# EAGLE board bechamel HDMI 4 board only NOT MOVING KEYS for AISLER now (EAGLE 9.6.2)
REV: C
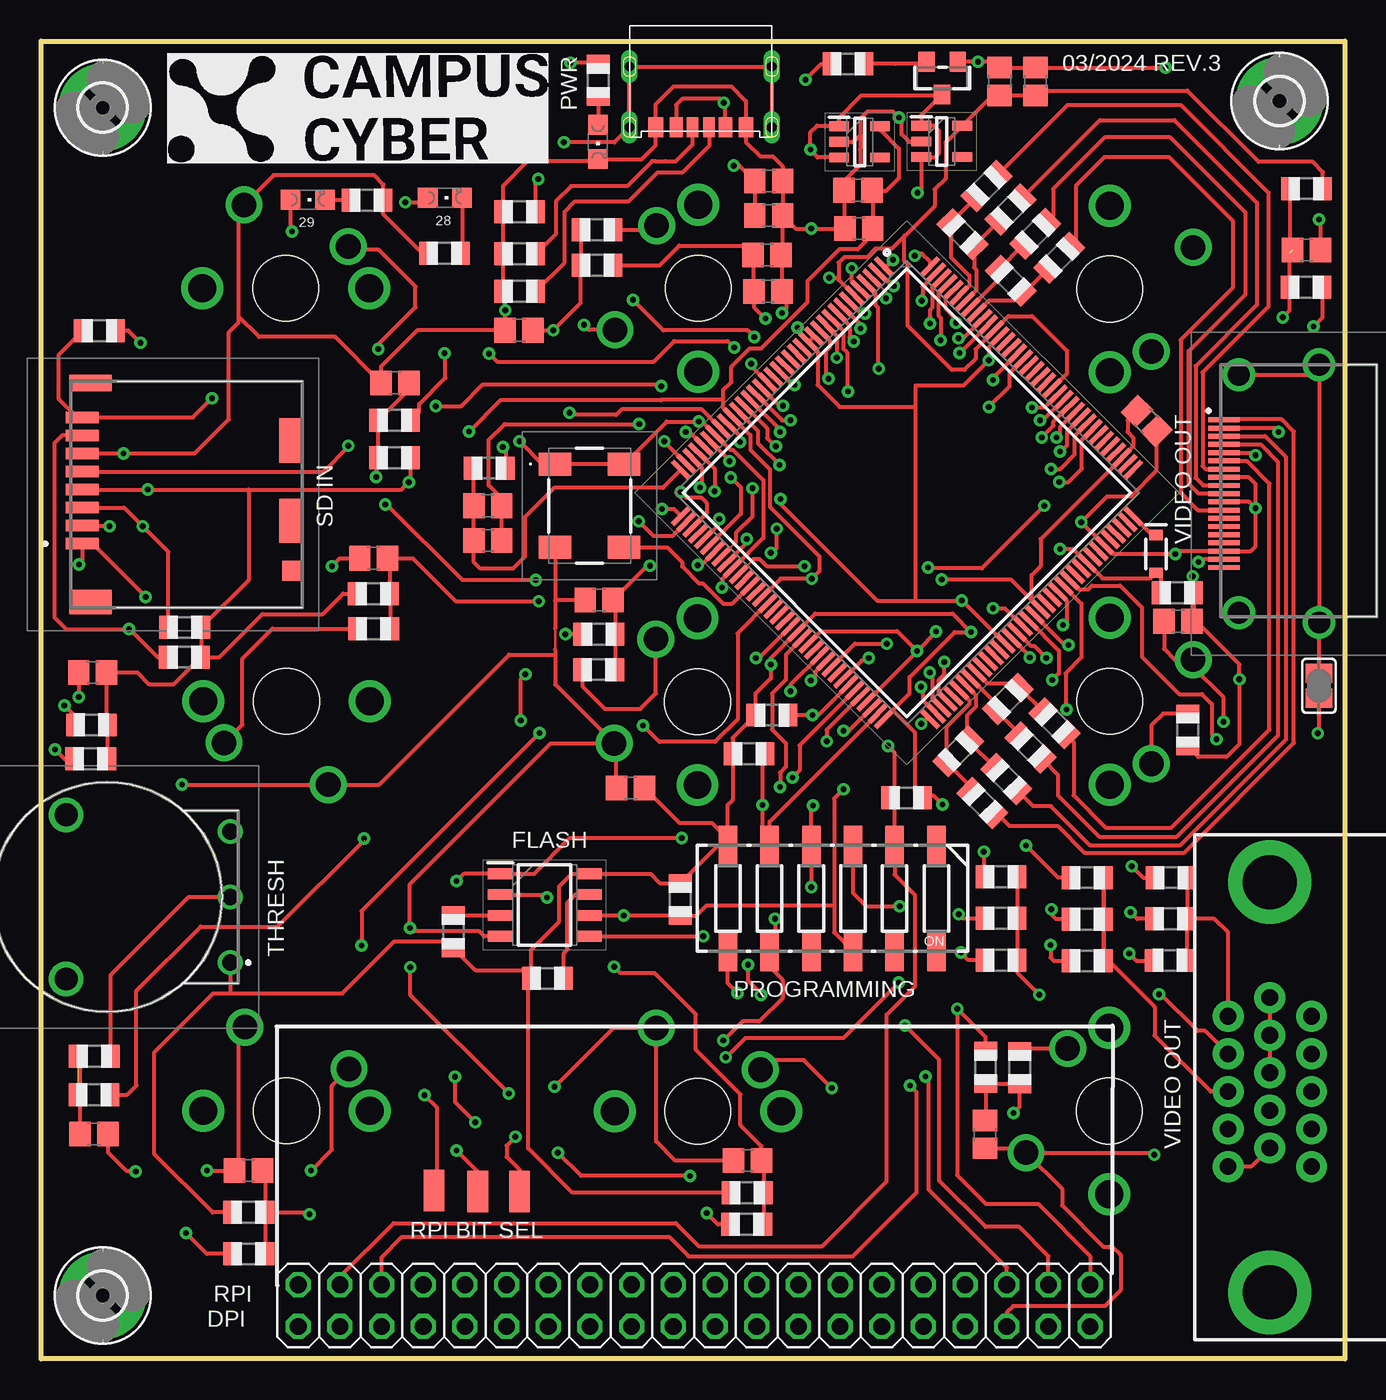
[diagram p5: board, top side]
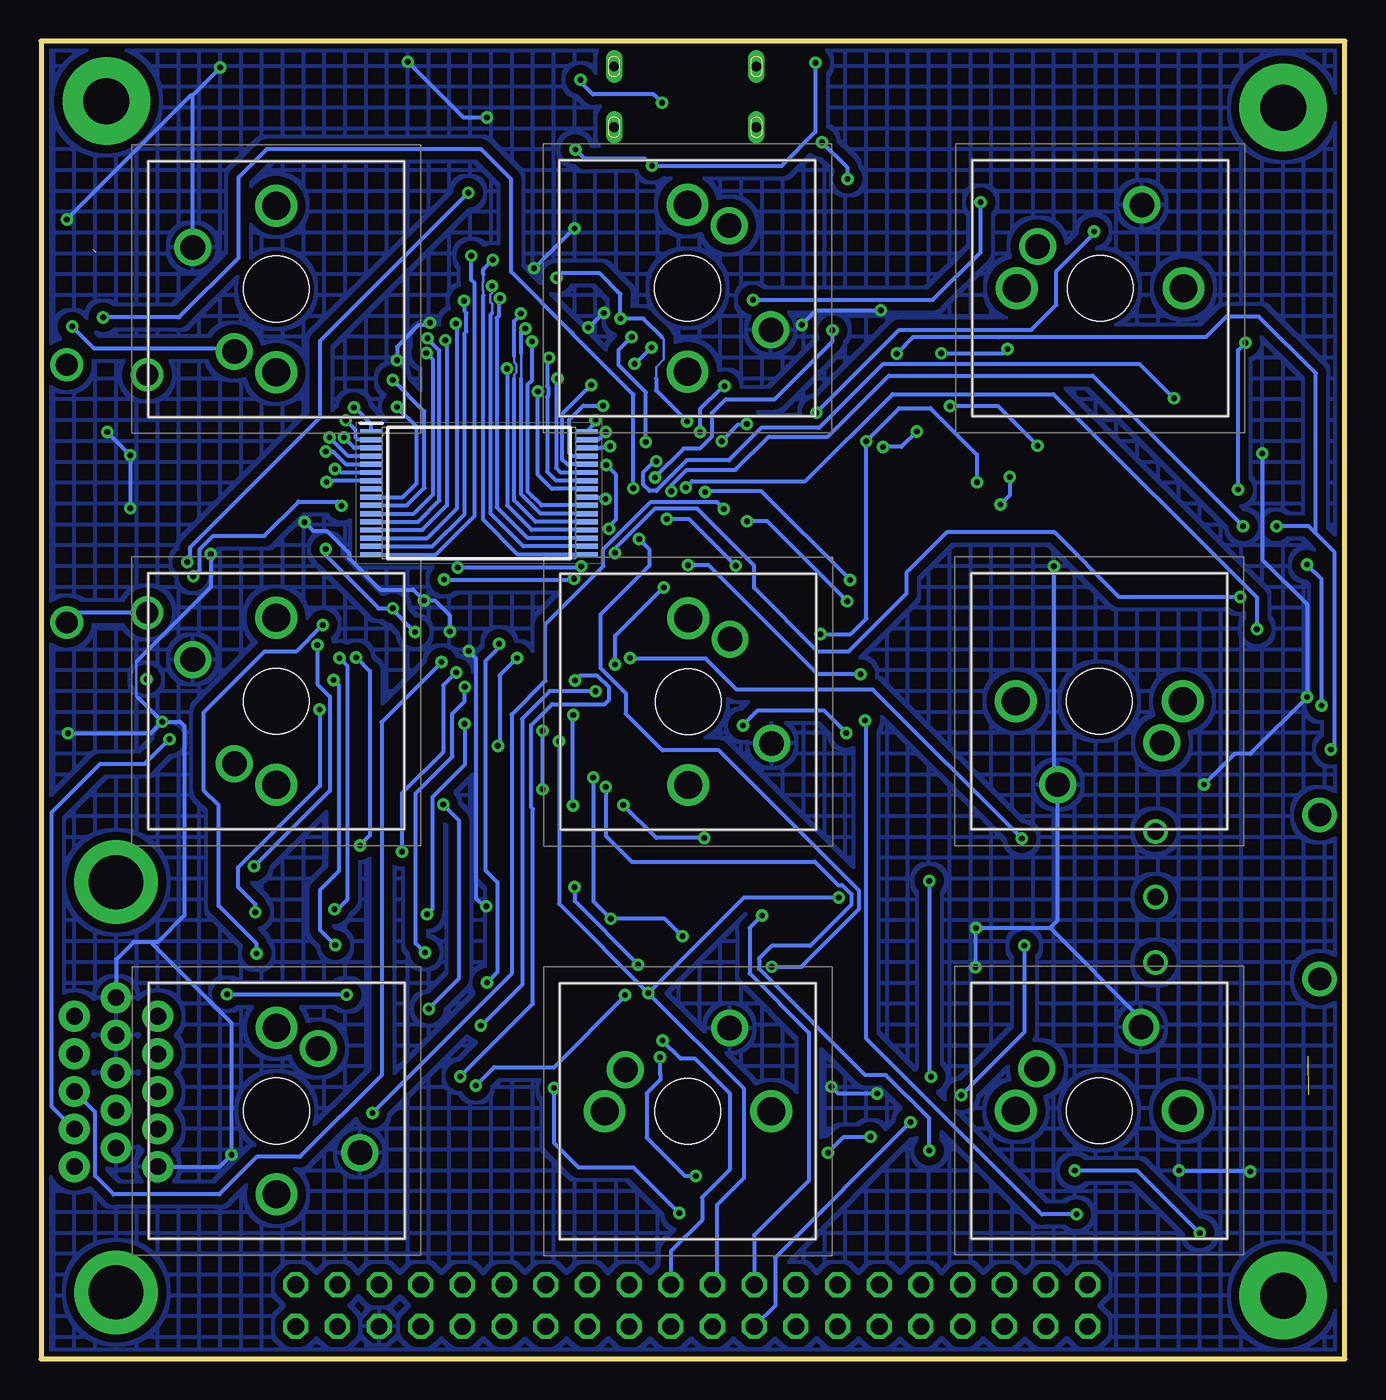
[diagram p6: board, bottom side, seen from below]

Size 79.45 x 80.31 mm. Coordinates in mm from the lower left corner, seen from the top.
Outline: 0,80.31 79.45,80.31 79.45,0 0,0 0,80.31
Copper layers (1*16): Top 0.035mm / dielectric 1.5mm / Bottom 0.035mm
Design rules "aisler_2_layer_complex *": minimum track width 0.125mm, minimum drill 0.1mm, track to track 20mil, track to pad 20mil, pad to pad 20mil, via to via 20mil, smd to smd 20mil, copper to edge 0.3mm, drill to drill 0.3mm, minimum pad ring 0.2mm, minimum via ring 0.2mm, stop-mask expansion 0mil, vias tented up to drill 0mil, thermal gap 10mil

## Footprints (pad centres in the part's own frame; a part is rotated, then mirrored left to right if it is on the bottom)
C0805 = smd 1.3 x 1.5: 1 -0.85,0; 2 0.85,0
SOD-323 = smd 0.63 x 0.83: A 1.15,0; C -1.15,0
R0805 = smd 1.1 x 1.4: 1 -1,0; 2 1,0
2,8-PAD = drill 2.8 pad 5.334: B2,8 0,0
SOT95P280X145-5N = smd 1.2 x 0.6: 1 -1.25,0.95; 2 -1.25,0; 3 -1.25,-0.95; 4 1.25,-0.95; 5 1.25,0.95
QFP50P2200X2200X160-144N = smd 1.475 x 0.3: 1 -10.738,8.75; 2 -10.738,8.25; 3 -10.738,7.75; 4 -10.738,7.25; 5 -10.738,6.75; 6 -10.738,6.25; 7 -10.738,5.75; 8 -10.738,5.25; 9 -10.738,4.75; 10 -10.738,4.25; 11 -10.738,3.75; 12 -10.738,3.25; 13 -10.738,2.75; 14 -10.738,2.25; 15 -10.738,1.75; 16 -10.738,1.25; 17 -10.738,0.75; 18 -10.738,0.25; 19 -10.738,-0.25; 20 -10.738,-0.75; 21 -10.738,-1.25; 22 -10.738,-1.75; 23 -10.738,-2.25; 24 -10.738,-2.75; 25 -10.738,-3.25; 26 -10.738,-3.75; 27 -10.738,-4.25; 28 -10.738,-4.75; 29 -10.738,-5.25; 30 -10.738,-5.75; 31 -10.738,-6.25; 32 -10.738,-6.75; 33 -10.738,-7.25; 34 -10.738,-7.75; 35 -10.738,-8.25; 36 -10.738,-8.75; 73 10.738,-8.75; 74 10.738,-8.25; 75 10.738,-7.75; 76 10.738,-7.25; 77 10.738,-6.75; 78 10.738,-6.25; 79 10.738,-5.75; 80 10.738,-5.25; 81 10.738,-4.75; 82 10.738,-4.25; 83 10.738,-3.75; 84 10.738,-3.25; 85 10.738,-2.75; 86 10.738,-2.25; 87 10.738,-1.75; 88 10.738,-1.25; 89 10.738,-0.75; 90 10.738,-0.25; 91 10.738,0.25; 92 10.738,0.75; 93 10.738,1.25; 94 10.738,1.75; 95 10.738,2.25; 96 10.738,2.75; 97 10.738,3.25; 98 10.738,3.75; 99 10.738,4.25; 100 10.738,4.75; 101 10.738,5.25; 102 10.738,5.75; 103 10.738,6.25; 104 10.738,6.75; 105 10.738,7.25; 106 10.738,7.75; 107 10.738,8.25; 108 10.738,8.75 | smd 0.3 x 1.475: 37 -8.75,-10.738; 38 -8.25,-10.738; 39 -7.75,-10.738; 40 -7.25,-10.738; 41 -6.75,-10.738; 42 -6.25,-10.738; 43 -5.75,-10.738; 44 -5.25,-10.738; 45 -4.75,-10.738; 46 -4.25,-10.738; 47 -3.75,-10.738; 48 -3.25,-10.738; 49 -2.75,-10.738; 50 -2.25,-10.738; 51 -1.75,-10.738; 52 -1.25,-10.738; 53 -0.75,-10.738; 54 -0.25,-10.738; 55 0.25,-10.738; 56 0.75,-10.738; 57 1.25,-10.738; 58 1.75,-10.738; 59 2.25,-10.738; 60 2.75,-10.738; 61 3.25,-10.738; 62 3.75,-10.738; 63 4.25,-10.738; 64 4.75,-10.738; 65 5.25,-10.738; 66 5.75,-10.738; 67 6.25,-10.738; 68 6.75,-10.738; 69 7.25,-10.738; 70 7.75,-10.738; 71 8.25,-10.738; 72 8.75,-10.738; 109 8.75,10.738; 110 8.25,10.738; 111 7.75,10.738; 112 7.25,10.738; 113 6.75,10.738; 114 6.25,10.738; 115 5.75,10.738; 116 5.25,10.738; 117 4.75,10.738; 118 4.25,10.738; 119 3.75,10.738; 120 3.25,10.738; 121 2.75,10.738; 122 2.25,10.738; 123 1.75,10.738; 124 1.25,10.738; 125 0.75,10.738; 126 0.25,10.738; 127 -0.25,10.738; 128 -0.75,10.738; 129 -1.25,10.738; 130 -1.75,10.738; 131 -2.25,10.738; 132 -2.75,10.738; 133 -3.25,10.738; 134 -3.75,10.738; 135 -4.25,10.738; 136 -4.75,10.738; 137 -5.25,10.738; 138 -5.75,10.738; 139 -6.25,10.738; 140 -6.75,10.738; 141 -7.25,10.738; 142 -7.75,10.738; 143 -8.25,10.738; 144 -8.75,10.738
SOIC127P600X175-8N = smd 1.525 x 0.65: 1 -2.712,1.905; 2 -2.712,0.635; 3 -2.712,-0.635; 4 -2.712,-1.905; 5 2.712,-1.905; 6 2.712,-0.635; 7 2.712,0.635; 8 2.712,1.905
SOP50P1340X125-32N = smd 1.325 x 0.3: 1 -6.562,3.75; 2 -6.562,3.25; 3 -6.562,2.75; 4 -6.562,2.25; 5 -6.562,1.75; 6 -6.562,1.25; 7 -6.562,0.75; 8 -6.562,0.25; 9 -6.562,-0.25; 10 -6.562,-0.75; 11 -6.562,-1.25; 12 -6.562,-1.75; 13 -6.562,-2.25; 14 -6.562,-2.75; 15 -6.562,-3.25; 16 -6.562,-3.75; 17 6.562,-3.75; 18 6.562,-3.25; 19 6.562,-2.75; 20 6.562,-2.25; 21 6.562,-1.75; 22 6.562,-1.25; 23 6.562,-0.75; 24 6.562,-0.25; 25 6.562,0.25; 26 6.562,0.75; 27 6.562,1.25; 28 6.562,1.75; 29 6.562,2.25; 30 6.562,2.75; 31 6.562,3.25; 32 6.562,3.75
SS53000001 = smd 0.3 x 1.9: 1 4.5,4.165; 2 4,4.165; 3 3.5,4.165; 4 3,4.165; 5 2.5,4.165; 6 2,4.165; 7 1.5,4.165; 8 1,4.165; 9 0.5,4.165; 10 0,4.165; 11 -0.5,4.165; 12 -1,4.165; 13 -1.5,4.165; 14 -2,4.165; 15 -2.5,4.165; 16 -3,4.165; 17 -3.5,4.165; 18 -4,4.165; 19 -4.5,4.165 | drill 1.33 pad 1.995: MH1 -7.25,3.265; MH2 7.25,3.265; MH3 7.85,-1.635; MH4 -7.85,-1.635
DM3CSSF = smd 0.7 x 2: 1 3,-6.35; 2 1.9,-6.35; 3 0.8,-6.35; 4 -0.3,-6.35; 5 -1.4,-6.35; 6 -2.5,-6.35; 7 -3.6,-6.35; 8 -4.7,-6.35 | smd 1 x 2.6: MP1 -6.8,-5.85 | smd 1.5 x 2.6: MP2 6.55,-5.85 | smd 2.7 x 1.4: MP3 -3.3,6.35; MP4 1.6,6.35 | smd 1.2 x 1.2: MP5 4.65,6.45
2X20 = drill 1.016 octagon: 1 -24.13,-1.27; 2 -24.13,1.27; 3 -21.59,-1.27; 4 -21.59,1.27; 5 -19.05,-1.27; 6 -19.05,1.27; 7 -16.51,-1.27; 8 -16.51,1.27; 9 -13.97,-1.27; 10 -13.97,1.27; 11 -11.43,-1.27; 12 -11.43,1.27; 13 -8.89,-1.27; 14 -8.89,1.27; 15 -6.35,-1.27; 16 -6.35,1.27; 17 -3.81,-1.27; 18 -3.81,1.27; 19 -1.27,-1.27; 20 -1.27,1.27; 21 1.27,-1.27; 22 1.27,1.27; 23 3.81,-1.27; 24 3.81,1.27; 25 6.35,-1.27; 26 6.35,1.27; 27 8.89,-1.27; 28 8.89,1.27; 29 11.43,-1.27; 30 11.43,1.27; 31 13.97,-1.27; 32 13.97,1.27; 33 16.51,-1.27; 34 16.51,1.27; 35 19.05,-1.27; 36 19.05,1.27; 37 21.59,-1.27; 38 21.59,1.27; 39 24.13,-1.27; 40 24.13,1.27
CHIPLED_0805 = smd 1.2 x 1.2: A 0,-1.05; C 0,1.05
SOT23-WIDE = smd 1 x 1.2: 1 -0.95,-1; 2 0.95,-1; 3 0,1
SMD1,27-2,54 = smd 1.27 x 2.54: 1 0,0
MX1A11NW = drill 1.499 pad 2.248: 1 0,0; 2 6.35,2.54 | drill 1.702 pad 2.553: MH1 -1.27,-2.54; MH2 8.89,-2.54 | hole 3.988: 3.81,-2.54
CTS-219-06J = smd 1.13 x 2.44: 1 -6.35,-3.215; 2 -3.81,-3.215; 3 -1.27,-3.215; 4 1.27,-3.215; 5 3.81,-3.215; 6 6.35,-3.215; 7 6.35,3.215; 8 3.81,3.215; 9 1.27,3.215; 10 -1.27,3.215; 11 -3.81,3.215; 12 -6.35,3.215
SJ = smd 1.168 x 1.6: 1 -0.762,0; 2 0.762,0
DB15 = drill 1.016 pad 1.88: 1 -4.32,-7.62; 2 -2.03,-7.62; 3 0.26,-7.62; 4 2.55,-7.62; 5 4.84,-7.62; 6 -5.46,-5.08; 7 -3.17,-5.08; 8 -0.88,-5.08; 9 1.41,-5.08; 10 3.7,-5.08; 11 -4.32,-2.54; 12 -2.03,-2.54; 13 0.26,-2.54; 14 2.55,-2.54; 15 4.84,-2.54 | drill 3.302 pad 5.08: G1 -12.5,-5.08; G2 12.5,-5.08
USCX-06FX-XXMX-01 = smd 0.7 x 1.2: CC1 0.5,-1.75; CC2 -0.5,-1.75 | smd 0.9 x 1.2: GND1 2.75,-1.75; GND2 -2.75,-1.75 | drill 0.6 long: SHIELD1 4.325,1.95; SHIELD2 4.325,-1.75; SHIELD3 -4.35,-1.75; SHIELD4 -4.35,1.95 | smd 0.8 x 1.2: VBUS1 1.5,-1.75; VBUS2 -1.5,-1.75
RV100F304K1BB10KB301 = drill 1 pad 1.5: 1 0,0; 2 4,0; 3 8,0 | drill 1.4 pad 2.1: 4 -1,10; 5 9,10
ECS3953M080BNTTR = smd 1.4 x 2: 1 -2.54,-2.1; 2 2.54,-2.1; 3 2.54,2.1; 4 -2.54,2.1

## Placement (x,y rotation side)
C1  0.1uF  [C0805]  34.01,46.25 0 top
C3  10uF  [C0805]  44.35,71.78 0 top
C4  10uF  [C0805]  49.83,68.88 180 top
C5  10uF  [C0805]  44.35,69.67 0 top
C6  0.1uF  [C0805]  20.27,48.79 0 top
C7  0.1uF  [C0805]  12.65,11.48 0 top
C8  0.1uF  [C0805]  43.05,12.09 0 top
C9  0.1uF  [C0805]  77.11,67.59 180 top
C10  0.1uF  [C0805]  29.13,62.69 0 top
C11  0.1uF  [C0805]  21.56,59.49 0 top
C12  0.1uF  [C0805]  58.42,77.85 90 top
C13  0.1uF  [C0805]  57.53,13.69 90 top
C14  0.1uF  [C0805]  69.29,44.96 0 top
C15  0.1uF  [C0805]  44.25,67.28 0 top
C16  10uF  [C0805]  3.15,41.83 0 top
C17  5.6nF  [C0805]  3.23,13.72 180 top
C18  0.1uF  [C0805]  44.3,65.06 0 top
C21  0.1uF  [C0805]  60.6,77.85 90 top
C22  0.1uF  [C0805]  27.23,49.89 0 top
C23  10uF  [C0805]  27.23,51.99 0 top
C25  0.1uF  [C0805]  35.92,34.8 180 top
C26  0.1uF  [C0805]  49.78,71.22 180 top
C27  0.1uF  [C0805]  67.37,57.16 315 top
D1  250mA/100V  [SOD-323]  67.95,49.06 270 top
FUSE  FUSE  [R0805]  49.17,78.92 180 top
H1  MOUNT-PAD-ROUND2.8  [2,8-PAD]  3.76,3.86 0 top
H5  MOUNT-PAD-ROUND2.8  [2,8-PAD]  3.76,76.25 0 top
H6  MOUNT-PAD-ROUND2.8  [2,8-PAD]  75.46,76.66 0 top
IC1  TLV73333PDBVT  [SOT95P280X145-5N]  54.89,74.19 0 top
IC2  ICE40HX1K-TQ144  [QFP50P2200X2200X160-144N]  52.77,52.78 315 top
IC3  TLV73312PDBVT  [SOT95P280X145-5N]  49.89,74.17 0 top
IC4  N25Q032A13ESC40F  [SOIC127P600X175-8N]  30.68,27.66 0 top
IC6  IS62WV2568BLL-55HLI  [SOP50P1340X125-32N]  52.76,52.77 0 bottom
J2  SS-53000-001  [SS53000001]  76.25,52.73 90 top
J3  DM3CS-SF  [DM3CSSF]  8.86,52.68 270 top
JP1  [2X20]  39.8,3.25 180 top
LED6  [CHIPLED_0805]  33.93,74.17 180 top
LED12  [CHIPLED_0805]  24.61,70.76 270 top
LED13  [CHIPLED_0805]  16.25,70.64 270 top
P-FET2  [SOT23-WIDE]  54.91,78.05 180 top
PAD1  [SMD1,27-2,54]  23.95,10.26 0 top
PAD2  [SMD1,27-2,54]  26.62,10.21 0 top
PAD3  [SMD1,27-2,54]  29.16,10.21 0 top
R1  470R  [R0805]  63.75,29.34 0 top
R2  1K  [R0805]  33.99,42.01 0 top
R3  10K  [R0805]  20.24,46.63 180 top
R4  10K  [R0805]  33.99,44.17 180 top
R5  1K  [R0805]  20.27,44.5 0 top
R6  10K  [R0805]  12.65,8.94 180 top
R7  1K  [R0805]  12.65,6.4 0 top
R8  10K  [R0805]  52.74,34.19 0 top
R9  10K  [R0805]  44.54,39.24 180 top
R10  10K  [R0805]  30.86,23.19 180 top
R11  10K  [R0805]  25.13,26.04 270 top
R12  10K  [R0805]  43.14,36.88 180 top
R13  10K  [R0805]  38.96,28 90 top
R14  100 ohm  [R0805]  27.3,54.29 0 top
R15  1K  [R0805]  63.75,26.8 0 top
R16  1.8K  [R0805]  63.75,24.26 0 top
R17  470R  [R0805]  58.5,29.39 0 top
R18  1K  [R0805]  58.5,24.31 0 top
R19  300 ohm  [R0805]  33.96,77.92 90 top
R20  1.8K  [R0805]  58.5,26.85 0 top
R21  10K  [R0805]  43.03,10.13 180 top
R22  1K  [R0805]  43,8.2 0 top
R23  10K  [R0805]  77.11,71.32 0 top
R24  1K  [R0805]  77.09,65.3 180 top
R25  470R  [R0805]  68.86,29.34 0 top
R26  1K  [R0805]  68.81,24.28 0 top
R27  1.8K  [R0805]  68.83,26.82 0 top
R28  270R  [R0805]  57.36,33.88 135 top
R29  270R  [R0805]  58.82,35.34 135 top
R30  120R  [R0805]  55.89,37.04 45 top
R31  270R  [R0805]  60.29,37.27 135 top
R32  270R  [R0805]  61.76,38.74 135 top
R33  120R  [R0805]  58.91,40.21 45 top
R34  270R  [R0805]  57.61,71.49 225 top
R35  270R  [R0805]  59.08,70.04 225 top
R36  100 ohm  [R0805]  24.59,67.39 0 top
R37  100 ohm  [R0805]  19.86,70.61 180 top
R38  120R  [R0805]  56.15,68.54 315 top
R39  270R  [R0805]  60.59,68.57 225 top
R40  270R  [R0805]  62.05,67.11 225 top
R41  120R  [R0805]  59.09,65.71 315 top
R42  1M  [R0805]  29.16,69.9 180 top
R43  5k1  [R0805]  29.16,67.36 180 top
R44  5k1  [R0805]  29.16,65.07 180 top
R45  10K  [R0805]  3.07,38.63 0 top
R46  10K  [R0805]  33.88,66.65 0 top
R47  1K  [R0805]  33.88,68.81 180 top
R48  10K  [R0805]  21.54,54.91 0 top
R49  1K  [R0805]  21.54,57.2 180 top
R50  10K  [R0805]  57.56,17.78 90 top
R51  1K  [R0805]  59.64,17.75 270 top
R52  10K  [R0805]  69.24,46.69 180 top
R53  1K  [R0805]  69.88,38.33 270 top
R54  10K  [R0805]  8.76,44.58 0 top
R55  10K  [R0805]  8.74,42.77 180 top
R56  1K8 ohm  [R0805]  3.25,18.44 0 top
R57  180 ohm  [R0805]  3.23,16.1 0 top
R58  10K  [R0805]  3.02,36.58 0 top
R59  10K  [R0805]  3.56,62.66 0 top
S1  MX1A-11NW  [MX1A11NW]  18.72,67.79 0 bottom
S2  MX1A-11NW  [MX1A11NW]  37.52,69.06 270 bottom
S3  MX1A-11NW  [MX1A11NW]  67.67,61.39 90 bottom
S4  MX1A-11NW  [MX1A11NW]  67.67,36.27 90 bottom
S5  MX1A-11NW  [MX1A11NW]  11.15,37.54 180 bottom
S6  MX1A-11NW  [MX1A11NW]  37.46,43.87 270 bottom
S7  MX1A-11NW  [MX1A11NW]  18.77,17.68 0 bottom
S8  MX1A-11NW  [MX1A11NW]  43.84,17.63 0 bottom
S9  219-06J  [CTS-219-06J]  48.21,28.07 180 top
S13  MX1A-11NW  [MX1A11NW]  62.56,18.92 270 bottom
SJ2  [SJ]  77.88,41.02 270 top
U$1  DB15  [DB15]  79.96,16.56 270 top
U$2  USBC-6P  [USCX-06FX-XXMX-01]  40.21,76.81 0 top
VR1  RV100F-30-4K1B-B10K-B301  [RV100F304K1BB10KB301]  11.53,24.16 90 top
Y2  ECS-3953M-080-BN-T-TR  [ECS3953M080BNTTR]  33.43,51.99 270 top

## Tracks (layer width: path | path; a pad name or v marks a point on that pad's centre or on a via)
1.2V  (via drill 0.35)
  Top 0.254: 50.79,75.12 IC3.5 51.14,74.9 52.27,73.76 52.27,71.96 51.49,71.17 50.69,71.17 | C26.1 50.69,71.17 | 50.69,71.17 C4.1 50.69,68.53 49.77,67.61 48.64,67.61 46.7,65.68 46.7,64.4 43.9,61.59 43.2,61.59 42.07,60.46 42.07,59.53 41.55,59.02 41.55,58.47 | 41.55,58.47 41.55,57.98 IC2.27 43.23,56.3 43.23,55.39 44.42,54.2 44.42,51.92 47.45,48.89 47.45,48.03 v46.96,47.55 45.07,47.55 IC2.51 | C27.1 66.22,57.21 66.22,56.49 66.57,56.13 66.57,55.62 IC2.111 60.91,49.96 60.91,48.31 60.37,47.77 60.37,46.23 60.88,45.72 IC2.92 59.11,47.5 v54.89,47.5 | v26.09,56.51 27.99,58.42 37.77,58.42 37.82,58.47 41.55,58.47 | v28.14,55.57 28.31,55.41 R14.2
  Bottom 0.254: v26.09,56.51 27.03,55.57 v28.14,55.57 | v54.89,47.5 47.02,47.5 v46.96,47.55
3.3V  (via drill 0.35)
  Top 0.254: 48.61,65.89 48.61,66.81 48.95,67.15 50.34,67.15 50.85,67.67 51.84,67.67 52.63,68.45 52.63,68.43 | 48.61,65.89 48.61,65.76 49.58,64.79 IC2.6 | 52.63,68.43 54.46,70.26 54.46,71.27 55.12,71.93 55.12,74.12 IC1.5 58,77 C12.1 C21.1 60.9,77.29 69.85,77.29 74.19,72.95 77.5,72.95 78.11,72.33 R23.2 77.88,71.56 | 52.63,68.43 52.58,68.38 52.58,66.93 52.81,66.7 52.81,62.97 55.5,60.27 56.26,60.27 56.95,60.96 56.95,61.54 IC2.133 58.95,63.55 60.4,63.55 62.51,61.44 62.51,60.04 IC2.123 | v62.1,49.35 v62.11,49.36 62.91,49.36 IC2.100 64.69,47.57 67.61,47.57 D1.A 68.24,47.61 R52.2 | IC2.72 51.9,39.54 | S9.6 42.06,31.48 40.87,32.66 38.9,32.66 C25.1 | S9.6 41.24,31.28 R13.2 37.72,29 37.16,29.57 IC4.8 32.33,29.57 31.57,28.8 31.57,26.64 29.86,24.93 R10.2 29.69,23.36 | 51.9,39.54 53.24,38.2 53.24,34.69 53.62,34.31 | 53.62,34.31 R8.2 | 29.69,23.36 29.35,23.7 26.47,23.7 R11.2 24.72,25.45 21.54,25.45 18.36,22.28 11.53,22.28 | R50.2 57.56,19.61 v55.83,21.34 55.83,11.2 57.58,9.45 60.76,9.45 63.93,6.27 JP1.1 | v54.94,33.78 54.41,34.31 53.62,34.31 | R21.2 32.39,10.13 29.69,12.83 29.69,23.36 | R6.2 10.46,8.94 6.91,12.49 6.91,18.69 10.49,22.28 11.53,22.28 | R3.2 18.41,46.63 17.16,45.39 13.49,45.39 10.87,42.77 R55.1 | R4.2 v31.95,44.17 | C15.1 43.4,67.23 | 43.4,67.23 43.4,65.11 C18.1 43.45,64.1 v44.15,63.4 | R46.2 37.69,66.65 38.89,67.84 42.79,67.84 43.4,67.23 | 51.9,39.54 52.93,40.57 52.93,41.55 55.68,44.3 v56.67,44.3 55.55,45.41 47.18,45.41 IC2.57 44.48,42.72 v44.48,42.32 44.48,41.48 43.54,40.54 R9.2 42.14,37.85 R12.2 42.14,34.06 41.86,33.78 S9.6 | v29.16,55.93 30.56,54.53 Y2.1 Y2.4 38.12,57.12 v40.08,57.12 40.29,57.12 IC2.30 42.03,55.39 42.18,55.39 44.02,53.55 44.02,50.04 IC2.46 41.5,47.52 v41.5,47.02
  Top 0.254: v58.01,45.75 58.74,45.75 IC2.89 | v48.03,65.89 48.61,65.89 | VR1.1 11.53,22.28 | R48.2 22.54,53.55 v22.42,53.43 21.97,52.98 12.65,52.98 | 12.65,52.98 v6.5,52.98 J3.4 | R55.1 8.08,41.12 6.58,41.12 5.87,41.83 C16.2 4,38.71 R45.2 4.02,38.58 R58.2 | 12.65,52.98 12.65,47.46 R54.2 9.76,42.81 R55.1 | v6.05,61.92 5.32,62.66 R59.2
  Bottom 0.152: 41.97,59.74 41.97,60.45 41.49,60.92 41.49,62.14 41.63,62.28
  Bottom 0.254: v56.67,44.3 58.01,45.64 v58.01,45.75 58.88,45.75 62.1,48.97 v62.1,49.35 | v54.94,33.78 54,32.84 54,23.16 v55.83,21.34 | v31.95,44.17 30.1,44.17 29.16,45.11 v29.16,55.93 27.15,57.94 25.25,57.94 22.42,55.1 v22.42,53.43 | v40.08,57.12 40.08,57.13 41.97,59.02 41.97,59.74 | 41.63,62.28 42.75,63.4 v44.15,63.4 44.15,64.9 45.44,66.19 47.73,66.19 v48.03,65.89 | v41.5,47.02 44.48,44.04 v44.48,42.32 | v6.05,61.92 6.5,61.48 v6.5,52.98
5V  (via drill 0.35)
  Top 0.254: P-FET2.3 54.86,77 | 54.86,77 53.64,75.78 IC1.1 54.42,75.14 54.74,74.83 54.74,73.48 54.5,73.24 IC1.3 53.64,71.29 v53.42,71.07 | IC3.1 48.64,75.16 | 48.64,75.16 48.64,75.64 50,77 54.86,77 | IC3.3 47.33,73.22 46.89,73.66 v46.89,73.71 46.89,74.75 47.3,75.16 48.64,75.16 | C5.1 C3.1 42.56,72.72 v42.22,72.72 | J2.18 70.88,48.73 70.71,48.56 v70.54,48.56 | R19.2 33.88,78.99 v32.26,78.99
  Bottom 0.254: v53.42,71.07 62.46,62.03 62.46,57.35 70.38,49.43 70.38,48.72 v70.54,48.56 | v46.89,73.71 46.3,73.13 42.62,73.13 v42.22,72.72 42.19,72.69 34.34,72.69 32.26,74.78 v32.26,78.99
5V?
  Top 0.254: P-FET2.2 53.84,78.93 52.07,78.93 52.06,78.92 FUSE.1
!CS1  (via drill 0.35)
  Top 0.254: IC2.25 44.25,56.71 44.25,56.11 44.73,55.63 v44.78,55.63
  Bottom 0.254: IC6.30 45.92,55.52 45.34,55.52 44.89,55.52 v44.78,55.63
!OE  (via drill 0.35)
  Top 0.254: IC2.23 45.17,57.2 v45.67,57.2
  Bottom 0.254: IC6.32 45.67,57.05 v45.67,57.2
!WE  (via drill 0.35)
  Top 0.254: IC2.118 62.51,56.51 62.51,55.65 62.13,55.27 v62.1,55.3
  Bottom 0.254: v62.1,55.3 61.65,55.3 60.88,54.53 59.34,54.53 IC6.5
A0  (via drill 0.35)
  Top 0.254: IC2.4 50.84,64.96 50.84,64.25 51,64.09 51,60.4 v51.05,60.35
  Bottom 0.254: IC6.20 49.55,50.52 51.05,52.02 v51.05,60.35
A1  (via drill 0.35)
  Top 0.152: v51.49,64.64 51.49,64.82 51.49,65.02 IC2.3
  Bottom 0.254: IC6.19 49.79,50.02 51.69,51.92 51.69,63.42 51.56,63.55 51.56,64.57 v51.49,64.64
A2  (via drill 0.35)
  Top 0.254: IC2.2 51.56,65.66 51.69,65.66 v51.97,65.38
  Bottom 0.152: 51.97,63.73 51.97,64.31 52.06,64.4 52.06,64.88 51.97,64.97 v51.97,65.38
  Bottom 0.254: IC6.18 50.05,49.52 52.07,51.54 52.07,63.63 51.97,63.73
A3  (via drill 0.35)
  Top 0.254: IC2.1 51.5,66.56 v51.92,66.98
  Bottom 0.152: 52.5,64.82 52.5,65.1 52.54,65.14 52.54,65.62 52.5,65.66 52.5,66.09
  Bottom 0.254: IC6.17 50.39,49.02 52.5,51.13 52.5,64.82 | v51.92,66.98 52.5,66.4 52.5,66.09
A4  (via drill 0.35)
  Top 0.254: IC2.144 54.18,66.86 53.68,67.36 53.37,67.36 v53.24,67.23
  Bottom 0.254: IC6.16 55.4,49.02 53.04,51.38 53.04,65.56 53.24,65.76 v53.24,67.23
A5  (via drill 0.35)
  Top 0.254: IC2.143 54.53,66.15 53.72,65.35 53.72,64.49 v53.67,64.49
  Bottom 0.254: IC6.15 55.61,49.52 53.65,51.49 53.65,62.49 53.53,62.6 53.53,63.73 53.65,63.85 53.65,64.46 v53.67,64.49
A6  (via drill 0.35)
  Top 0.254: IC2.142 54.86,65.85 54.31,65.3 54.31,64.06 54.18,63.93 v54.18,63.09
  Bottom 0.254: IC6.14 55.92,50.02 54.13,51.82 54.13,63.09 v54.18,63.09
A7  (via drill 0.35)
  Top 0.254: IC2.141 54.71,64.97 54.71,63.55 54.83,63.43 54.83,62.09 v54.81,62.08
  Bottom 0.254: IC6.13 56.21,50.52 54.71,52.02 54.71,61.98 v54.81,62.08
A8  (via drill 0.35)
  Top 0.254: v60.99,56.16 61.7,56.87 61.7,57.12 61.98,57.4 62,57.43 62.65,58.07 IC2.120
  Bottom 0.254: IC6.3 60.37,55.52 60.99,56.13 v60.99,56.16
A9  (via drill 0.35)
  Top 0.254: IC2.121 62.28,58.43 61.06,57.2 | 61.06,57.2 60.93,57.07 | 61.06,57.2 v60.88,57.2
  Bottom 0.254: IC6.2 60.16,56.02 60.3,56.16 60.3,56.62 v60.88,57.2
A10  (via drill 0.35)
  Top 0.254: IC2.24 45.03,56.63 v45.03,56.49
  Bottom 0.254: IC6.31 45.51,56.02 v45.03,56.49
A11  (via drill 0.35)
  Top 0.254: v60.39,57.99 61.16,57.99 IC2.122
  Bottom 0.254: v60.39,57.99 60.34,57.99 59.32,56.97 IC6.1
A12  (via drill 0.35)
  Top 0.254: IC2.135 56.19,62.2 v55.91,62.2
  Bottom 0.254: IC6.12 56.47,51.02 55.17,52.32 55.17,61.44 55.91,62.18 v55.91,62.2
A13  (via drill 0.35)
  Top 0.254: v61.87,56.16 62.1,56.39 62.1,56.79 63.02,57.71 IC2.119
  Bottom 0.254: IC6.4 60.73,55.02 v61.87,56.16
A14  (via drill 0.35)
  Top 0.254: IC2.134 55.99,61.3 v55.97,61.3
  Bottom 0.254: IC6.11 56.74,51.52 55.55,52.7 55.55,60.88 v55.97,61.3
A15  (via drill 0.35)
  Top 0.254: v62.05,53.44 62.61,53.44 63.42,54.25 63.42,56.01 IC2.116
  Bottom 0.254: IC6.7 61.98,53.52 v62.05,53.44
A16  (via drill 0.35)
  Top 0.254: IC2.129 58.01,59.79 v58.01,59.66
  Bottom 0.254: IC6.10 57.15,52.02 56.08,53.09 56.08,57.73 v58.01,59.66 58.01,59.74
A17  (via drill 0.35)
  Top 0.254: IC2.128 59,60.07 59,59.26 v57.76,58.01
  Bottom 0.254: IC6.9 57.41,52.52 56.57,53.37 56.57,56.79 57.76,57.99 v57.76,58.01
ADC_IN  (via drill 0.35)  (1 unrouted)
  Top 0.254: 19.69,31.57 v19.69,31.72 | v43.56,42.72 43.77,42.72 IC2.56 | R57.2 5.26,16.1 5.82,16.66 5.82,22.43 9.73,26.34 14.4,26.34 19.69,31.62
  Bottom 0.254: v19.69,31.72 28.75,40.79 37.06,40.79 38.94,42.67 43.51,42.67 v43.56,42.72
BLUE
  Top 0.254: R16.2 R15.2 R1.2 64.75,24.57 67.87,21.45 67.87,19.7 71.27,16.3 U$1.3
BLUE_1  (via drill 0.35)
  Top 0.254: IC2.87 60.25,42.83 v60.25,42.75 | R1.1 61.98,29.34 v60.02,31.29
  Bottom 0.254: v60.25,42.75 59.41,41.91 59.41,31.9 v60.02,31.29
BLUE_2  (via drill 0.35)
  Top 0.254: R15.1 61.87,26.8 61.57,27.09 v61.57,27.41 | v61.27,42.72 60.54,43.44 60.35,43.44 IC2.88
  Bottom 0.254: v61.57,27.41 61.37,27.41 60.78,27.99 60.78,42.24 v61.27,42.72
BLUE_3  (via drill 0.35)
  Top 0.254: IC2.90 62.03,43.17 62.03,41.78 v61.62,41.38 | v61.52,25.22 61.52,24.46 61.72,24.26 R16.1
  Bottom 0.254: v61.62,41.38 61.32,41.07 61.32,29.72 62.46,28.57 62.46,26.16 v61.52,25.22
CLK+
  Top 0.254: R39.2 59.83,67.86 R41.1 58.38,65.81 IC2.137
CLK-
  Top 0.254: R40.2 59.94,65 R41.2 59.31,64.52 57.79,64.52 IC2.136
CMD  (via drill 0.35)
  Top 0.254: J3.3 5.07,51.88 v6.2,50.75 7.76,49.18 R54.1 | IC2.33 41.05,54.25 v41.05,52.88
  Bottom 0.254: v41.05,52.88 41.05,53.24 40.11,54.18 37.14,54.18 35.1,56.21 31.5,56.21 27.79,59.92 15.37,59.92 v6.2,50.75
CS2  (via drill 0.35)
  Top 0.254: v61.54,54.23 62.1,54.23 62.99,55.12 62.99,56.26 63.72,56.99 IC2.117
  Bottom 0.254: IC6.6 61.21,54.02 61.42,54.23 v61.54,54.23
DAT0  (via drill 0.35)
  Top 0.254: J3.7 1.29,56.28 0.81,55.8 0.81,45.19 1.52,44.48 v5.36,44.48 5.41,44.48 7.11,42.77 R55.2 | IC2.34 40.26,54.33 40.26,53.21 v40.16,53.11
  Bottom 0.254: v40.16,53.11 39.78,53.49 32.87,53.49 27.56,58.8 17.75,58.8 5.36,46.41 v5.36,44.48
DAT1  (via drill 0.35)
  Top 0.254: R59.1 1.09,61.2 1.09,58.5 2.21,57.38 J3.8 9.25,57.38 v10.41,58.55 | IC2.31 41.96,54.75 v41.96,54.71
  Bottom 0.254: v10.41,58.55 12.5,60.63 28.14,60.63 32.03,56.74 35.56,56.74 37.54,54.76 40.1,54.76 41.96,52.91 42.37,52.91 42.75,53.29 42.75,54.05 42.09,54.71 v41.96,54.71
DAT2  (via drill 0.35)
  Top 0.254: v2.31,48.41 2.51,48.62 J3.1 3.15,49.68 6.38,46.46 v6.38,46.43 | R45.1 2.07,39.18 v1.42,39.83 | IC2.26 43.69,56.56 43.69,55.8 v45,54.49 v45,54.48 | v44.83,50.6 44.83,49.4 44.55,49.12 v44.48,49.12
  Bottom 0.254: v2.31,48.41 1.45,47.55 1.45,39.85 v1.42,39.83 | v6.38,46.43 13.74,46.43 17.68,50.37 24.26,50.37 26.72,47.9 26.72,46.63 30.25,43.1 32.11,43.1 35.99,46.99 35.99,48.34 39.47,51.82 42.04,51.82 44.48,49.38 v44.48,49.12 | v44.83,50.6 44.83,50.73 44.4,51.16 44.4,53.88 v45,54.48
DAT3  (via drill 0.35)
  Top 0.254: R58.1 1.42,36.58 v0.86,37.13 | v4.17,50.75 2.55,50.75 J3.2 | v27.31,61.26 27.79,60.78 37.34,60.78 38.58,62.03 41.83,62.03 42.23,61.63 v42.25,61.65 | IC2.21 43.28,60.5 v43.28,60.65
  Bottom 0.254: v0.86,37.13 0.65,37.34 0.65,49.19 1.77,50.3 | v4.17,50.75 2.21,50.75 1.77,50.3 | 1.77,50.3 1.77,60.06 5.23,63.53 7.21,63.53 8.46,62.28 21.09,62.28 21.11,62.26 26.31,62.26 v27.31,61.26 | v42.25,61.65 43.24,60.65 v43.28,60.65
DATA0+
  Top 0.254: R34.2 56.9,70.71 R38.1 55.45,67.13 56.57,66.01 56.57,65.41 IC2.139
DATA0-
  Top 0.254: R35.2 R38.2 56.86,66.51 57,66.37 57,65.14 IC2.138
DATA1+
  Top 0.254: R31.2 59.59,38.13 R33.1 58.21,39.92 IC2.80
DATA1-
  Top 0.254: R32.2 61.05,39.49 R33.2 59.37,41.17 57.66,41.17 IC2.81
DATA2+
  Top 0.254: IC2.78 56.59,40.12 56.59,39.93 55.18,38.52 R30.1 56.65,34.86 R28.2
DATA2-
  Top 0.254: R29.2 56.6,37.57 R30.2 56.41,37.93 56.41,39.19 56.97,39.75 56.97,40.45 IC2.79
FPGA_CLK
  Top 0.254: Y2.3 38.15,49.45 39.06,48.54 39.06,48.29 40.09,47.27 40.34,47.27 41.58,46.02 42.11,46.02 IC2.49
GND  (via drill 0.35)
  Top 0.152: 55.12,64.19 55.12,64.29 55.12,64.46 55.12,64.53 | 31.33,44.5 31.33,43.23
  Top 0.254: IC1.2 53.61,74.17 52.91,74.17 52.45,74.62 52.45,75.49 v52.29,75.65 51.92,76.02 50.37,76.02 49.96,75.62 49.96,74.6 | IC3.2 49.53,74.17 49.81,74.45 | C5.2 C3.2 45.2,72.68 44.6,73.28 43.84,73.28 42.96,74.16 U$2.GND1 42.96,76.65 42.06,77.55 38.56,77.55 37.46,76.45 U$2.GND2 37.46,73.96 36.62,73.12 LED6.C 33.82,73.01 29.68,73.01 28.16,71.49 R42.2 | P-FET2.1 v57.1,79.05 58.07,79.05 C12.2 C21.2 v68.53,78.7 | C5.2 45.99,68.88 v46.94,68.88 C4.2 48.99,71.17 | 48.99,71.17 C26.2 | 49.81,74.45 49.91,74.35 49.91,73.71 | 49.91,73.71 49.91,72.77 48.99,71.84 48.99,71.17 | IC2.140 55.12,64.67 55.12,64.53 | IC2.13 | IC2.13 IC2.14 | IC2.69 v53.38,43.14 | v53.38,43.14 54.56,44.31 v54.54,44.34 | S9.3 49.48,28.4 50.29,27.58 v52.32,27.58 | IC4.4 27.01,25.76 26.7,26.06 22.68,26.06 v22.48,26.26 22.48,28.93 31.06,37.52 S6.2 | 28.16,69.93 R42.2 | C13.1 59.75,12.84 S13.2 | Y2.2 31.33,46.23 | 31.33,46.23 31.33,44.5 | 31.33,43.23 31.33,42.93 | 31.33,42.93 31.33,41.11 S6.2 | 12.03,63.55 12.03,69.99 S1.2 14.17,72.14 20.29,72.14 20.86,71.57 R37.1 20.86,69.75 23.23,67.39 R36.1 | 12.03,63.55 12.03,63.14 11.44,62.56 11.44,57.26 9.36,55.18 v5.03,55.18 J3.6 | C27.2 67.98,54.13 66.4,52.55 64.95,52.55 v63.39,51 IC2.103 65.34,49.05 v69.11,49.05 69.3,49.23 J2.17 73.72,49.23 74.02,49.53 v74.02,51.84 | C8.1 38.66,12.09 37.49,13.26 S8.2 34.87,20.17 v31.29,16.59 | S7.2 12.03,19.83 12.03,11.71 C7.1 v10.11,11.48 | 31.33,42.93 28.52,42.93 20.6,35 S5.2 v8.59,35 | C1.1 33.14,46.23 31.33,46.23 | U$1.6 U$1.7 U$1.8 | U$1.10 73.74,11.72 U$1.5 | S13.2 67.72,12.57 v67.84,12.45 | C5.2 45.2,67.39 C15.2 45.15,67.23 C18.2 45.41,64.8 45.41,63.99 v45.15,63.74
  Top 0.254: v28.5,16.18 22.5,22.17 v22.5,23.88 | C25.2 35.07,37.37 S6.2 | v72.06,38.84 72.06,40.31 70.21,42.16 S4.2 69.09,42.62 68.44,43.27 C14.1 | v77.88,69.44 77.96,69.36 C9.1 | v74.02,51.84 73.63,52.23 J2.11 | v74.02,51.84 74.02,53.31 73.6,53.73 J2.8 | J2.5 73.85,55.23 v74.02,55.07 | J2.2 72.1,56.72 75.18,56.72 v75.41,56.49 | SJ2.2 77.88,38.2 v77.8,38.13 | IC2.14 46.1,62.63 v46.1,62.86 | IC2.59 47.52,44.35 52.17,44.35 v53.38,43.14 | 56.15,46.22 IC2.86 | 56.15,46.22 56.14,46.23 v56.11,46.23 | v55.75,63.14 55.75,63.37 55.12,64.01 55.12,64.19 | IC2.132 57.76,61.65 v57.76,60.86 56.23,59.33 53.29,59.33 53.29,58.01 | IC2.14 47.32,61.41 47.32,59.36 48.67,58.01 53.29,58.01 | v45.06,52.4 45.06,52.12 50.96,46.22 53.29,46.22 | 53.29,46.22 56.15,46.22 | 53.29,58.01 53.29,46.22 | IC2.5 49.4,65.69 v49.4,66.47 | C17.1 4.08,12.6 5.23,11.44 5.75,11.44 v5.77,11.43 | R42.2 R43.2 R44.2 28.16,65.18 28.28,65.05 v28.28,63.91 C10.1 22.94,62.69 20.71,60.47 C11.1 17.92,62.28 13.3,62.28 12.03,63.55 | S13.2 62.23,10.36 62.23,9.36 64.74,6.85 65.29,6.85 65.79,6.35 65.79,4.18 64.83,3.23 59.23,3.23 58.85,2.84 JP1.6 | C16.1 v2.3,40.33 | C6.1 18.21,48.79 v17.73,48.31 | 49.81,74.45 49.96,74.6 | 49.96,74.6 49.96,73.76 49.91,73.71 | S2.2 33.4,62.71 v33.1,63.02
  Bottom 0.152: 73.63,42.49 73.63,40.39 73.53,40.28
  Bottom 0.254: v53.38,43.14 52.95,42.71 52.95,28.08 52.45,27.58 v52.32,27.58 | 17.96,26.26 v22.48,26.26 22.5,26.24 v22.5,23.88 | U$1.5 68.57,11.72 v67.84,12.45 67.84,20.47 72.77,25.4 | v52.29,75.65 53.7,75.65 v57.1,79.05 | S3.2 70.21,77.02 | v31.29,16.59 30.89,16.18 v28.5,16.18 | 72.77,25.4 72.34,25.4 70.71,27.03 70.71,36.93 70.71,38.58 70.97,38.84 v72.06,38.84 72.07,38.82 | 72.77,25.4 73.81,25.4 74.88,24.33 U$1.6 | 73.63,42.49 69.11,47.02 v69.11,49.05 | 73.53,40.28 72.07,38.82 | v68.53,78.7 70.21,77.02 | 70.21,77.02 70.23,77 70.32,77 v77.88,69.44 | v74.02,51.84 v74.02,55.07 75.41,56.46 v75.41,56.49 | v77.8,38.13 72.77,38.13 72.07,38.82 | v46.1,62.86 46.05,62.92 46.03,62.92 45.2,63.74 v45.15,63.74 | v54.54,44.34 54.54,45.32 55.45,46.23 v56.11,46.23 56.77,46.89 58.78,46.89 60.68,48.79 60.68,49.1 62.05,50.47 62.87,50.47 v63.39,51 | v55.75,63.14 55.91,62.99 56.45,62.99 57.76,61.68 v57.76,60.86 | IC6.24 45.18,52.52 v45.06,52.4 | v49.4,66.47 46.99,68.88 v46.94,68.88 | 17.96,26.26 12.42,20.73 S7.2 | v5.77,11.43 5.79,11.46 10.08,11.46 v10.11,11.48 | 17.96,26.26 17.5,26.72 17.5,34.34 | 17.5,34.34 S5.2 | v17.73,48.31 17.73,34.57 17.5,34.34 | v5.03,55.18 5.03,48.72 2.3,45.99 v2.3,40.33 5.75,36.88 6.71,36.88 v8.59,35 | v33.1,63.02 32.21,63.91 v28.28,63.91
  pour Bottom (hatched): 79.43,0.03 0,0.03 0,80.26 79.43,80.26
GREEN  (via drill 0.35)
  Top 0.254: R17.2 R20.2 R18.2 59.5,23.54 v60.83,22.2 | v68.12,22.22 68.25,22.22 70.49,19.99 70.94,19.99 U$1.2
  Bottom 0.254: v60.83,22.2 68.1,22.2 v68.12,22.22
GREEN_1  (via drill 0.35)
  Top 0.254: IC2.75 54.31,40.28 54.31,41.68 v54.15,41.83 | v57.46,30.91 57.46,29.43 R17.1
  Bottom 0.254: v54.15,41.83 54.94,41.05 54.94,36.98 57.46,34.47 v57.46,30.91
GREEN_2  (via drill 0.35)
  Top 0.254: R18.1 56.52,24.31 v56.06,24.76 | IC2.74 53.75,40.14 53.75,40.84 v53.63,40.96
  Bottom 0.254: v56.06,24.76 56.62,25.32 56.62,34.47 54.38,36.71 54.38,39.32 53.63,40.07 v53.63,40.96
GREEN_3  (via drill 0.35)
  Top 0.254: IC2.73 53.93,39 v53.65,38.71 | v55.93,27.1 56.19,26.85 R20.1
  Bottom 0.254: v53.65,38.71 53.65,36.2 55.6,34.24 55.6,27.43 v55.93,27.1
H_SYNC  (via drill 0.35)
  Top 0.254: IC2.76 54.71,40.58 54.71,41.4 55.04,41.73 v55.04,42.47
  Bottom 0.254: v55.04,42.47 58.7,38.81 58.7,17.3 63.68,12.32 66.29,12.32 68.58,10.03 75.03,10.03 76.15,11.15 76.15,15.03 U$1.13
H_SYNC_IN  (via drill 0.35)
  Top 0.254: JP1.5 58.85,5.56 54.08,10.34 54.08,17.22 v53.9,17.22 | v46.91,41.35 47.17,41.6 47.17,41.87 IC2.62
  Bottom 0.254: v53.9,17.22 49.48,21.64 49.48,33.53 49.58,33.63 49.58,38.63 48.31,39.9 45.11,39.9 44.83,40.18 44.83,40.92 45.54,41.63 46.63,41.63 v46.91,41.35
I/O0  (via drill 0.35)
  Top 0.254: v50.22,63.7 50.09,63.83 49.86,63.83 49.25,64.44 IC2.7
  Bottom 0.152: 50.62,59.74 50.62,59.97 50.48,60.11 50.48,60.59 50.62,60.73 50.62,61.11
  Bottom 0.254: IC6.21 49.32,51.02 50.62,52.32 50.62,59.74 | 50.62,61.11 50.62,63.25 50.22,63.65 v50.22,63.7
I/O1  (via drill 0.35)
  Top 0.254: IC2.8 49.86,63.12 49.86,62.87 v49.94,62.79
  Bottom 0.152: 50.19,59.74 50.19,61.32
  Bottom 0.254: IC6.22 49,51.52 50.19,52.7 50.19,59.74 | 50.19,61.32 50.19,62.61 50.11,62.61 v49.94,62.79 49.89,62.79
I/O2  (via drill 0.35)
  Top 0.254: IC2.9 48.54,63.7 49.28,62.97 49.28,62.26 v49.53,62
  Bottom 0.254: IC6.23 48.95,52.02 49.81,52.88 49.81,59.36 49.53,59.64 v49.53,62
I/O3  (via drill 0.35)
  Top 0.254: IC2.10 48.89,62.67 48.89,61.57 49.12,61.34 49.12,59 v49.17,58.95
  Bottom 0.254: IC6.25 48.32,53.02 49.17,53.87 v49.17,58.95
I/O4  (via drill 0.35)
  Top 0.254: IC2.11 48.49,62.36 v48.49,61.01
  Bottom 0.254: IC6.26 48.06,53.52 48.62,54.08 48.62,58.63 48.55,58.69 48.55,59.21 48.62,59.28 48.62,60.88 v48.49,61.01
I/O5  (via drill 0.35)
  Top 0.254: IC2.12 48.08,62.06 48.08,61.7 47.84,61.45 47.84,60.12 47.98,59.97 v47.98,59.74
  Bottom 0.254: IC6.27 47.77,54.02 48.06,54.3 48.06,59.66 v47.98,59.74
I/O6  (via drill 0.35)
  Top 0.254: IC2.19 45,60.18 45.82,59.36 v45.92,59.36
  Bottom 0.254: IC6.28 47.38,54.52 47.68,54.81 47.68,57.61 v45.92,59.36
I/O7  (via drill 0.35)
  Top 0.254: IC2.22 44.99,58.09 v45.21,58.09
  Bottom 0.254: IC6.29 47.07,55.02 47.27,55.22 47.27,57.23 46.41,58.09 v45.21,58.09
ICE_CDONE  (via drill 0.35)
  Top 0.254: 52.02,34.34 S9.2 52.02,29.51 53.24,28.3 53.24,22.68 51.54,20.98 51.54,10.82 47.6,6.88 40.08,6.88 38.68,8.28 21.49,8.28 18.21,5 JP1.37 | 52.02,34.34 52.02,36.96 v51.61,37.36 | v50.44,42.72 50.28,42.56 50.01,42.56 48.92,41.47 IC2.65 | 52.02,34.34 51.9,34.34 R8.1
  Bottom 0.254: v51.61,37.36 51.51,37.46 51.51,41.66 v50.44,42.72
ICE_CREST  (via drill 0.35)
  Top 0.254: IC2.66 47.37,39.24 v47.02,39.24 R9.1 | v47.04,33.73 46.94,33.63 S9.4 v46.94,28.75 | JP1.35 20.75,6.2 22,7.44 38.28,7.44 39.47,6.25 49.45,6.25 53.34,10.13 53.34,16.28 v52.96,16.66 | v43.08,24.03 43.08,23.09 43.87,22.3 v43.87,22.17
  Bottom 0.254: v47.04,33.73 47.04,39.22 v47.02,39.24 | v46.94,28.75 46.94,27.91 43.08,24.05 v43.08,24.03 | v43.87,22.17 43.87,22.1 48.18,17.78 51.84,17.78 v52.96,16.66
ICE_MISO  (via drill 0.35)
  Top 0.254: IC2.68 47.88,38.34 v47.88,37.64 | v42.44,22.3 41.86,22.89 S9.7 | IC4.2 30.66,28.3 v30.84,28.12
  Bottom 0.254: v47.88,37.64 47.88,27.74 v42.44,22.3 | v30.84,28.12 36.63,28.12 v42.44,22.3 | JP1.21 38.25,4.8 38.25,9.4 36.6,11.05 36.6,16.46 v42.44,22.3
ICE_MOSI  (via drill 0.35)
  Top 0.254: IC2.67 46.23,37.4 46.23,35.86 v45.8,35.43 | v44.73,26.82 44.73,25.18 S9.8 44.4,23.89 45.19,23.1 45.19,22 43.76,20.57 42.75,20.57 v41.58,19.41 | IC4.5 v40.36,25.76
  Bottom 0.254: v45.8,35.43 45.8,27.89 v44.73,26.82 41.43,26.82 v40.36,25.76 | v41.58,19.41 40.49,18.31 39.62,18.31 37.49,16.18 37.49,11.53 39.17,9.85 39.17,8.46 41.07,6.55 JP1.19
ICE_SCK  (via drill 0.35)
  Top 0.254: IC2.70 49.23,38.28 v48.9,38.28 | v48.9,34.72 48.34,34.16 48.34,27.63 | S9.10 48.34,25.99 48.34,27.63 | 48.34,27.63 40.56,27.63 39.93,27 R13.1 38.94,27.03 v35.51,27.03 IC4.6
  Bottom 0.254: v48.9,38.28 v48.9,34.72 | v35.51,27.03 36.27,26.26 36.27,23.49 32.66,19.89 32.66,10.87 35.99,7.54 JP1.23
ICE_SS_B  (via drill 0.35)
  Top 0.254: R12.1 43.96,36.7 v43.96,33.76 43.96,31.72 S9.5 44.4,32.74 IC2.71 | v39.04,31.75 32.23,31.75 30.05,29.57 IC4.1 25.76,29.57 v25.32,29.13 | v25.22,17.2 25.22,15.67 v26.47,14.43
  Bottom 0.254: v39.04,31.75 41.96,31.75 v43.96,33.76 | JP1.24 34.72,3.25 34.72,6.17 v26.47,14.43 | v25.32,29.13 25.32,17.3 v25.22,17.2
KEY_0  (via drill 0.35)
  Top 0.254: C13.2 57.56,14.57 R50.1 57.58,16.75 R51.2 59.64,15.37 v59.26,14.99 | IC2.37 38.57,51.79 v37.85,51.79
  Bottom 0.254: v59.26,14.99 50.77,23.47 50.77,39.27 48.72,41.33 48.72,44.79 45.19,48.32 45.19,49.35 42.34,52.2 38.26,52.2 v37.85,51.79
KEY_0_LED  (via drill 0.35)
  Top 0.254: IC2.28 42.6,56.24 v42.6,55.88 | v43.46,62.28 43.05,62.69 37.92,62.69 v36.07,64.54 | v22.2,70.48 23.29,70.48 LED12.A
  Bottom 0.254: v42.6,55.88 42.6,58.9 44.27,60.58 44.27,61.47 v43.46,62.28 | v36.07,64.54 25.1,64.54 22.2,67.44 v22.2,70.48
KEY_1  (via drill 0.35)
  Top 0.254: R5.2 21.27,46.61 R3.1 21.24,48.67 C6.2 22.64,48.79 25.26,46.18 v30.33,46.18 | v36.42,51.05 37.31,50.16 38.49,50.16 IC2.38
  Bottom 0.254: v30.33,46.18 35.2,51.05 v36.42,51.05
KEY_1_LED  (via drill 0.35)
  Top 0.254: IC2.29 40.26,57.86 35.38,57.86 35.05,57.53 32.33,57.53 v32.21,57.66 | v15.29,68.71 15.2,68.79 LED13.A
  Bottom 0.254: v32.21,57.66 27.15,62.71 19.1,62.71 17.58,64.24 17.58,66.29 15.29,68.58 v15.29,68.71
KEY_2  (via drill 0.35)
  Top 0.254: v20.98,52.07 21.08,52.07 25.68,47.47 v30.15,47.47 | v38.99,52.83 39.34,52.48 40.26,52.48 40.56,52.17 40.56,51.53 IC2.39 | C11.2 22.41,59.08 R49.2 R48.1 20.42,54.8 v20.42,53.75
  Bottom 0.254: v30.15,47.47 35.59,52.91 38.91,52.91 v38.99,52.83 | v20.42,53.75 20.42,52.63 v20.98,52.07
KEY_3  (via drill 0.35)
  Top 0.254: R2.2 R4.1 34.99,46.13 C1.2 36.94,48.34 v37.11,48.34 | v41.33,51.18 41.33,50.88 IC2.41
  Bottom 0.254: v37.11,48.34 39.95,51.18 v41.33,51.18
KEY_4  (via drill 0.35)
  Top 0.254: R47.2 R46.1 32.88,64.35 v31.22,62.69 C10.2 | v42.04,53.72 42.65,53.11 42.65,51.49 IC2.42
  Bottom 0.254: v42.04,53.72 40.28,55.47 39.29,55.47 38.58,56.18 38.58,57.63 37.72,58.5 34.75,58.5 31.22,62.03 v31.22,62.69
KEY_5  (via drill 0.35)
  Top 0.254: C7.2 13.65,11.33 R6.1 | R6.1 R7.2 | R6.1 16.23,8.94 v16.36,8.81 | v29.24,38.91 29.24,41.45 v29.52,41.73 | v40.02,48.38 40.24,48.38 IC2.43
  Bottom 0.254: v16.36,8.81 18.47,8.81 29.16,19.51 29.16,38.84 v29.24,38.91 | v29.52,41.73 32.13,41.73 38.78,48.38 v40.02,48.38
KEY_6  (via drill 0.35)  (1 unrouted)
  Top 0.152: 42.34,49.77 IC2.44
  Top 0.254: 76.11,65.33 R24.2 | R24.2 76.09,67.41 | C9.2 76.11,67.74 R23.1 | v75.67,63.47 76.09,63.9 R24.2 | 42.34,49.77 42.34,50.34 43.36,51.36 v43.36,53.06
  Bottom 0.254: v75.67,63.47 71.04,63.47 67.41,67.11 67.41,72.01 65.71,73.71 52.63,73.71 50.8,71.88 50.8,66.24 47.04,62.48 47.04,62.45 43.36,58.77 v43.36,53.06
KEY_7  (via drill 0.35)
  Top 0.254: R22.2 44.03,8.23 R21.1 44.03,11.97 C8.2 43.9,12.97 42.62,14.25 42.62,16.13 39.9,18.85 39.9,21.01 37.39,23.52 35.31,23.52 v34.93,23.9 | v43,49.96 42.86,49.81 42.86,49.59 41.82,48.55 IC2.45
  Bottom 0.254: v34.93,23.9 33.12,23.9 29.59,27.43 29.59,28.52 38.15,37.08 41.58,37.08 43.83,39.33 43.83,40.58 45.36,42.11 45.36,45.36 42.77,47.95 42.39,48.34 42.39,49.35 v43,49.96
KEY_8  (via drill 0.35)
  Top 0.152: 43.43,48.74 IC2.47
  Top 0.254: R53.2 70.51,36.69 72.26,36.69 73.03,37.46 v73.03,41.42 73.03,42.33 70.4,44.96 C14.2 70.24,45.06 R52.1 70.18,46.75 v70.18,47.7 | 43.43,48.74 43.79,48.74 44.22,48.31 v46.53,48.31 | v61.14,51.99 57.33,48.18 54.1,48.18 v54.05,48.23
  Bottom 0.254: v70.18,47.7 69.77,48.11 69.77,49.35 68.96,50.16 65.84,50.16 63.75,52.25 61.39,52.25 v61.14,51.99 | v54.05,48.23 46.61,48.23 v46.53,48.31
N$1
  Top 0.254: IC4.7 32.56,28.3 32.08,27.81 32.08,24.94 31.86,24.72 R10.1
N$2
  Top 0.254: R19.1 33.96,75.24 LED6.A
N$4
  Top 0.254: R11.1 25.14,27.03 IC4.3
N$6
  Top 0.254: U$2.CC2 39.71,74.02 38.68,73 38.05,73 37.41,73 37.24,73 35.71,71.48 32.31,71.48 31.37,70.54 31.37,68.55 30.18,67.36 R43.1
N$7
  Top 0.254: IC2.108 67.71,50.21 D1.C
N$8  (via drill 0.35)
  Top 0.254: C22.2 C23.2 28.08,52.27 28.16,52.35 27.28,53.24 27.28,56.01 28.25,56.97 v36.45,56.97 | v37.97,55.93 37.97,55.91 IC2.35
  Bottom 0.254: v36.45,56.97 36.47,56.97 36.5,56.95 36.96,56.95 v37.97,55.93
N$9
  Top 0.254: R14.1 26.38,54.22 C23.1 C22.1 26.38,48.55 26.77,48.16 28.75,48.16 29.49,48.89 29.49,51.31 31.27,53.09 37.89,53.09 IC2.36
N$10  (via drill 0.35)
  Top 0.254: U$2.SHIELD2 U$2.SHIELD1 U$2.SHIELD4 U$2.SHIELD3 34.94,74.14 v31.86,74.14 | R42.1 30.16,71.76 v30.3,71.91
  Bottom 0.254: v30.3,71.91 30.3,72.58 v31.86,74.14
N$11
  Top 0.254: R56.2 4.25,23.4 9,28.16 VR1.2
N$13
  Top 0.254: R28.1 58.32,33.17 59,32.49 61.95,32.49 63.58,30.86 69.67,30.86 76.35,37.54 76.35,56.51 75.61,57.26 72.11,57.26 J2.1
N$17
  Top 0.254: U$2.CC1 40.71,73.93 39.07,72.29 37.57,72.29 35.81,70.54 32.54,70.54 31.9,69.9 31.9,66.82 R44.1
N$20
  Top 0.254: J2.MH2 77.29,59.98 J2.MH3 J2.MH4 77.88,44.87 SJ2.1
  Bottom 0.254: J2.MH1 77.29,45.48 J2.MH4
N$21  (1 unrouted)
  Top 0.254: C17.2 2.38,18.32 R56.1
N$22
  Top 0.254: R29.1 60.47,33.7 61.53,33.7 63.91,31.32 69.43,31.32 75.87,37.76 75.87,54.97 74.6,56.24 J2.3
N$23
  Top 0.254: R31.1 61.96,35.6 61.96,34.34 64.48,31.83 69.22,31.83 75.39,38 75.39,54.66 74.32,55.73 J2.4
N$24
  Top 0.254: R36.2 25.66,67.46 LED12.C
N$25
  Top 0.254: LED13.C 18.84,70.64 R37.2
N$26
  Top 0.254: R32.1 62.92,37.57 62.92,34.34 64.88,32.38 68.89,32.38 74.85,38.35 74.85,53.34 73.46,54.73 J2.6
N$27  (via drill 0.35)
  Top 0.254: IC2.52 42.44,44.22 42.44,38.98 41.07,37.61 37.68,37.61 v36.68,38.61 | v30.38,38.15 19.53,27.3 v19.53,25.2 | v23.37,16.08 24.12,15.33 24.12,10.43 PAD1.1
  Bottom 0.254: v36.68,38.61 35.76,39.52 31.75,39.52 v30.38,38.15 | v19.53,25.2 19.53,19.91 v23.37,16.08
N$32
  Top 0.254: R34.1 62.55,76.43 69.44,76.43 74.79,71.08 74.79,64.12 70.79,60.12 70.79,54.41 70.97,54.23 J2.7
N$33
  Top 0.254: R35.1 64.52,75.49 69.06,75.49 74.09,70.46 74.09,64.24 70.36,60.5 70.36,53.7 70.82,53.23 J2.9
N$34
  Top 0.254: J2.10 70.54,52.73 69.93,53.34 69.93,61.42 73.41,64.9 73.41,69.85 68.81,74.45 64.82,74.45 61.68,71.3 61.68,69.66 R39.1
N$36
  Top 0.254: J2.12 70.49,51.73 69.44,52.78 69.44,62.1 72.62,65.28 72.62,69.37 68.73,73.25 64.82,73.25 63.06,71.49 63.06,68.12 R40.1
N$37
  Top 0.254: R2.1 32.99,41 34.37,39.62 36.53,39.62 37.47,40.56 S6.1
N$38
  Top 0.254: S5.1 12.27,38.66 12.27,42.67 14.1,44.5 R5.1
N$39  (via drill 0.35)
  Top 0.254: S7.1 17.73,16.64 17.73,12.75 v16.46,11.48 | R7.1 10.11,6.4 v8.84,7.67
  Bottom 0.254: v8.84,7.67 12.65,11.48 v16.46,11.48
N$40  (via drill 0.35)
  Top 0.254: v48.18,16.51 46.48,18.21 44.42,18.21 S8.1 | v40.56,8.89 41.25,8.2 R22.1
  Bottom 0.254: v40.56,8.89 43.33,11.66 46.69,11.66 48.18,13.16 v48.18,16.51
N$41  (via drill 0.35)
  Top 0.254: R24.1 78.09,63.46 v77.55,62.92
  Bottom 0.254: v77.55,62.92 76.23,61.59 67.87,61.59 S3.1
N$44
  Top 0.254: R47.1 37.26,68.81 S2.1
N$45  (via drill 0.35)
  Top 0.254: S1.1 18.92,67.6 20.58,67.6 22.81,65.36 22.81,64.08 20.55,61.82 v20.55,61.54 | R49.1 23.04,57.7 23.04,58.19 24.64,59.79 24.64,61.24 v24.59,61.29
  Bottom 0.254: v24.59,61.29 20.8,61.29 v20.55,61.54
N$46
  Top 0.254: R51.1 59.81,18.92 S13.1
N$47
  Top 0.254: R53.1 68.39,39.33 67.67,38.61 S4.1
N$65  (via drill 0.35)
  Top 0.254: IC2.58 45.39,42.92 45.39,41.4 44.55,40.56 44.55,38.35 45.39,37.52 45.39,36.09 45.03,35.74 v45.03,34.85 | v25.32,12.7 26.62,11.4 PAD2.1
  Bottom 0.254: v45.03,34.85 45.03,31.88 43.46,30.3 32.31,30.3 30.88,28.88 30.63,28.88 30.07,28.32 30.07,27.69 32.59,25.17 34.93,25.17 35.69,24.41 35.69,23.77 29.21,17.3 27.97,17.3 25.32,14.66 v25.32,12.7
N$66  (via drill 0.35)
  Top 0.254: IC2.63 49.59,43.59 v51.54,43.59 | v52.27,22.94 48.9,19.56 42.93,19.56 41.76,18.39 v41.73,18.39 | v39.55,11.15 32.92,11.15 v31.5,12.57 | v28.91,13.54 28.37,13 28.37,12.32 29.16,11.53 PAD3.1
  Bottom 0.254: v51.54,43.59 51.54,43.36 52.38,42.52 52.38,29.79 51.64,29.06 51.64,23.57 v52.27,22.94 | v41.73,18.39 41.73,17.35 41.71,17.32 41.71,17.02 42.55,16.18 42.55,13.49 40.21,11.15 v39.55,11.15 | v31.5,12.57 30.53,13.54 v28.91,13.54
PRE_FUSE  (via drill 0.35)
  Top 0.254: U$2.VBUS1 41.71,76.45 v41.61,76.56 41.38,76.78 39.07,76.78 38.71,76.43 U$2.VBUS2 | FUSE.2 47.55,78.92 v46.58,77.95
  Bottom 0.254: v41.61,76.56 42.11,77.06 45.82,77.06 46.58,77.83 v46.58,77.95
RED
  Top 0.254: R25.2 69.86,26.85 R27.2 | R27.2 69.83,24.31 R26.2 | U$1.1 72.34,25.99 71.51,26.82 R27.2
RED_1  (via drill 0.35)
  Top 0.254: IC2.91 62.37,43.54 62.59,43.54 v62.61,43.51 | v66.47,30.02 67.16,29.34 R25.1
  Bottom 0.254: v62.61,43.51 62.61,41.12 61.85,40.36 61.85,34.62 66.45,30.02 v66.47,30.02
RED_2  (via drill 0.35)
  Top 0.254: IC2.95 62.51,46.22 62.51,44.96 v62.28,44.73 | v66.32,24.71 66.75,24.28 R26.1
  Bottom 0.254: v62.28,44.73 63.91,43.1 65.84,43.1 69.52,39.42 69.52,34.64 68.63,33.75 68.63,27.61 66.32,25.3 v66.32,24.71
RED_3  (via drill 0.35)
  Top 0.254: R27.1 66.8,26.82 v66.4,27.23 | IC2.96 63.4,46.03 63.4,42.75 62.43,41.78 62.43,39.62 v62.48,39.57
  Bottom 0.254: v66.4,27.23 66.4,27.71 67.46,28.78 67.46,29.93 62.46,34.93 62.46,39.55 v62.48,39.57
SD_CLK  (via drill 0.35)
  Top 0.254: J3.5 17.22,54.08 18.72,55.57 v18.72,55.65 | v24.05,58.06 25.6,58.06 26.92,59.38 37.72,59.38 37.8,59.31 v37.8,59.28 | IC2.32 39.51,56.49 v39.29,56.49
  Bottom 0.254: v18.72,55.65 21.13,58.06 v24.05,58.06 | v39.29,56.49 39.29,57.86 37.87,59.28 v37.8,59.28
V_SYNC  (via drill 0.35)
  Top 0.254: IC2.97 62.67,47.48 63.25,46.9 63.82,46.9 64.04,47.12 65.75,47.12 67.08,45.8 67.08,42.8 69.37,40.51 70.74,40.51 71.35,39.9 71.35,38.05 v71.63,37.77
  Bottom 0.254: U$1.14 78.79,15.39 78.79,33.32 75.84,36.27 73.13,36.27 v71.63,37.77
V_SYNC_IN  (via drill 0.35)
  Top 0.254: JP1.3 61.39,6.27 59.61,8.05 57.56,8.05 54.74,10.87 54.74,18.24 v52.65,20.32 | IC2.61 45.67,41.08 v45.67,40.69
  Bottom 0.254: v45.67,40.69 48.46,40.69 50.14,39.01 50.14,22.81 52.63,20.32 v52.65,20.32

## Text on the board
tPlace: 03/2024 REV.3 | PWR | 29 | 28 | SD IN | VIDEO OUT | FLASH | THRESH | PROGRAMMING | VIDEO OUT | RPI BIT SEL | RPI / DPI